# EAGLE design TOUv2 (EAGLE 6.4)
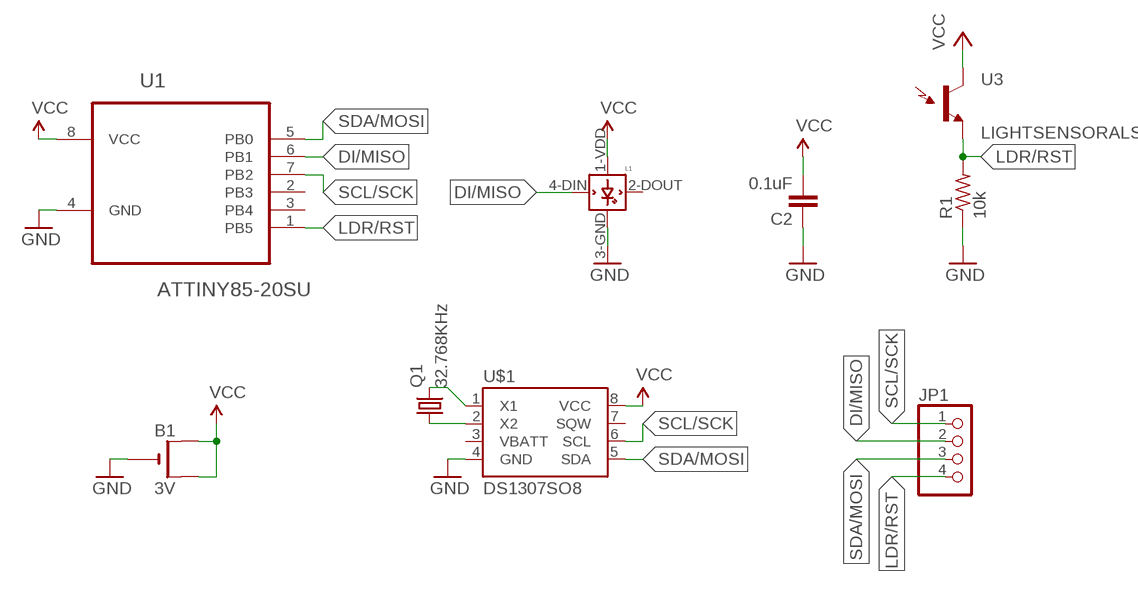
[diagram p0: schematic, sheet 1]

## Parts
B1  3V  CR2032THM  [CR2032-THRU]
C2  0.1uF  CAP0603-CAP  [0603-CAP]
JP1  PINHD-1X4  [1X04]
L1  WS2812B  [WS2812B]
Q1  32.768KHz  CRYSTALCTS406  [CTS406]
R1  10k  R-US_R0402  [R0402]
U1  ATTINY85-20SU  [SOIC127P798X216-8N]
U3  LIGHTSENSORALS  [ALS-PT19]
U$1  DS1307SO8  [SO08]

## Nets
DI/MISO: JP1.2 L1.4-DIN(DIN) U1.6(PB1)
GND: B1.- C2.1 L1.3-GND(GND) R1.1 U1.4(GND) U$1.4(GND)
LDR/RST: JP1.4 R1.2 U1.1(PB5) U3.E(E1)
N$1: Q1.1 U$1.2(X2)
N$2: Q1.3 U$1.1(X1)
SCL/SCK: JP1.1 U1.7(PB2) U$1.6(SCL)
SDA/MOSI: JP1.3 U1.5(PB0) U$1.5(SDA)
VCC: B1.+1(+) B1.+2(+1) C2.2 L1.1-VDD(VDD) U1.8(VCC) U3.C(C1) U$1.8(VCC)
Unconnected: L1.2-DOUT(DOUT) U1.2(PB3) U1.3(PB4) U$1.3(VBATT) U$1.7(SQW)

## Library data of the parts
B1 = adafruit:CR2032
C2 = SparkFun:CAP: Capacitor Standard 0603 ceramic capacitor, and 0.1" leaded capacitor.
JP1 = pinhead:PINHD-1X4: PIN HEADER
L1 = adafruit:WS2812B
Q1 = adafruit:CRYSTAL: CRYSTAL; OC_FARNELL: unknown; OC_NEWARK: unknown
R1 = adafruit:R-US_: RESISTOR, American symbol
U1 = Atmel_By_element14_Batch_1-00:ATTINY85-20SU: 8-bit Microcontroller with In-System Programmable Flash; MPN: ATTINY85-20SU; OC_FARNELL: 1455164; OC_NEWARK: 58M3797; PACKAGE: SOIC-8; SUPPLIER: Atmel
U3 = SparkFun-Sensors:LIGHTSENSOR: Ambient Light Sensor Simple light detection sensor. Output varies with light intensity input. Spark Fun Electronics SKU : COM-08348; PROD_ID: IC-11836
U$1 = SparkFun-FreqCtrl:DS1307: I2C real-time clock with battery backup.

## Board
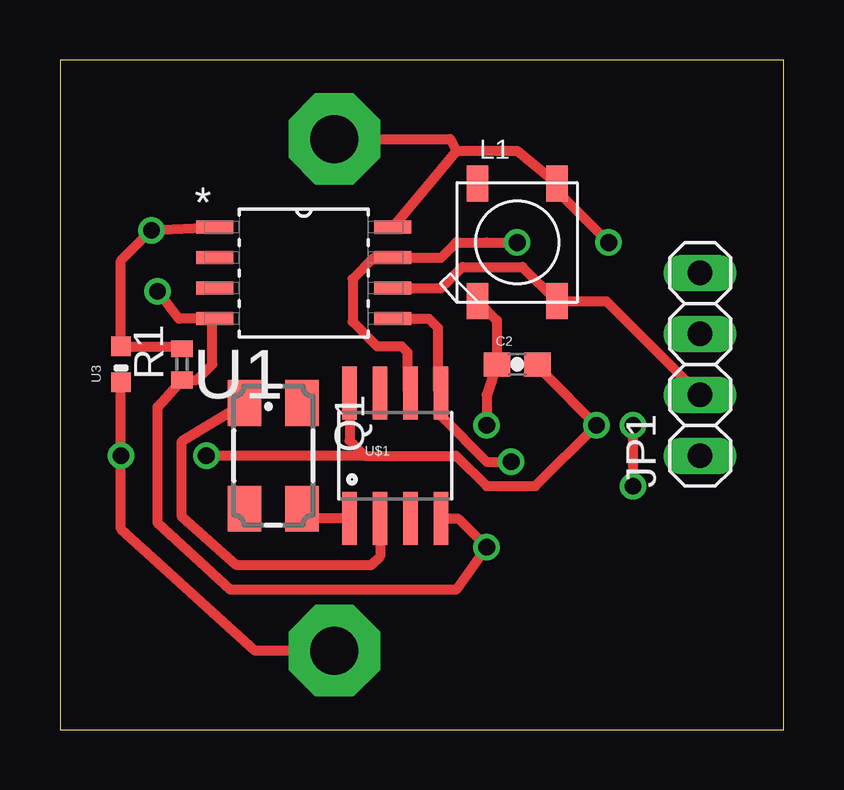
[diagram p1: board, top side]
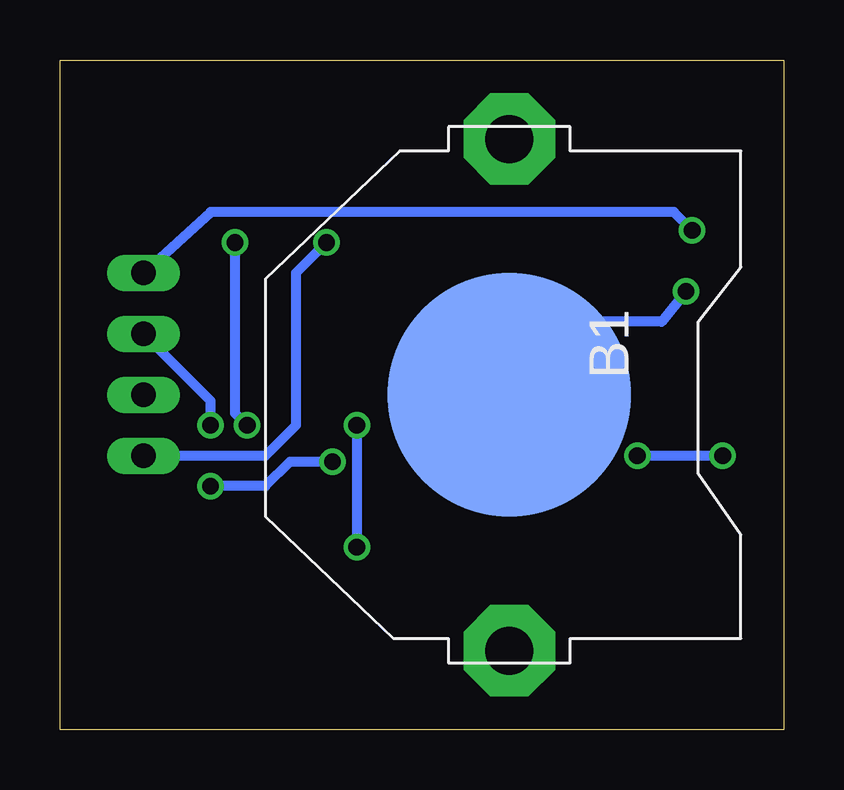
[diagram p2: board, bottom side, seen from below]

Size 30.15 x 27.93 mm. Coordinates in mm from the lower left corner, seen from the top.
Outline: 0,0 30.15,0 30.15,27.93 0,27.93 0,0
Copper layers (1*16): Top 0.035mm / dielectric 1.5mm / Bottom 0.035mm
Design rules "default": minimum track width 10mil, minimum drill 24mil, track to track 8mil, track to pad 8mil, pad to pad 8mil, via to via 8mil, smd to smd 8mil, copper to edge 40mil, drill to drill 8mil, minimum pad ring 10mil, minimum via ring 8mil, stop-mask expansion 4mil, vias tented up to drill 0mil, thermal gap 10mil

### Footprints (pad centres in the part's own frame; a part is rotated, then mirrored left to right if it is on the bottom)
CR2032-THRU = drill 2 pad 3.81 octagon: +1 -10.668,0; +2 10.668,0 | smd 10.16 x 10.16: - 0,0
0603-CAP = smd 1.1 x 1: 1 -0.85,0; 2 0.85,0
1X04 = drill 1.016 long: 1 -3.81,0; 2 -1.27,0; 3 1.27,0; 4 3.81,0
WS2812B = smd 1.5 x 0.9: 1-VDD 2.45,-1.65; 2-DOUT 2.45,1.65; 3-GND -2.45,1.65; 4-DIN -2.45,-1.65
CTS406 = smd 1.9 x 1.4: 1 -2.2,-1.2; 2 2.2,-1.2; 3 2.2,1.2; 4 -2.2,1.2
R0402 = smd 0.7 x 0.9: 1 -0.65,0; 2 0.65,0
SOIC127P798X216-8N = smd 1.549 x 0.533: 1 -3.708,1.905; 2 -3.708,0.635; 3 -3.708,-0.635; 4 -3.708,-1.905; 5 3.708,-1.905; 6 3.708,-0.635; 7 3.708,0.635; 8 3.708,1.905
ALS-PT19 = smd 0.8 x 0.8: C -0.75,0; E 0.75,0
SO08 = smd 0.61 x 2.21: 1 -1.905,-2.616; 2 -0.635,-2.616; 3 0.635,-2.616; 4 1.905,-2.616; 5 1.905,2.616; 6 0.635,2.616; 7 -0.635,2.616; 8 -1.905,2.616

### Placement (x,y rotation side)
B1  11.43,13.97 270 bottom
C2  19.05,15.24 0 top
JP1  26.67,15.24 90 top
L1  19.05,20.32 90 top
Q1  8.89,11.43 270 top
R1  5.08,15.24 90 top
U1  10.16,19.05 0 top
U3  2.54,15.24 90 top
U$1  13.97,11.43 0 top

### Tracks (layer width: path | path; a pad name or v marks a point on that pad's centre or on a via)
DI/MISO
  Top 0.406: U1.6 15.88,18.41 16.76,19.3 19.27,19.3 L1.4-DIN 22.77,17.87 JP1.2
GND  (via drill 0.7)
  Top 0.406: v17.78,12.7 17.78,13.97 C2.1 18.2,17.07 L1.3-GND | U$1.4 16.59,8.81 v17.78,7.62 16.51,5.84 7.11,5.84 4.06,8.64 4.06,13.46 R1.1 5.7,14.59 6.35,15.24 6.35,17.04 U1.4 4.95,17.15 v4.06,18.29
  Bottom 0.406: v17.78,12.7 v17.78,7.62 | v4.06,18.29 5.08,17.02 8.13,17.02 B1.-
LDR/RST  (via drill 0.7)
  Top 0.406: R1.2 4.98,15.99 U3.E 2.54,19.56 v3.81,20.83 U1.1
  Bottom 0.406: v3.81,20.83 4.57,21.59 23.88,21.59 JP1.4
N$1
  Top 0.406: U$1.2 13.34,7.24 12.95,6.86 7.37,6.86 5.08,8.89 5.08,12.04 Q1.1
N$2
  Top 0.406: U$1.1 10.09,8.81 Q1.3
SCL/SCK  (via drill 0.7)
  Top 0.406: 14.68,13.97 U$1.6 14.48,14.17 14.48,15.75 14.22,16 13.21,16 12.19,17.02 12.19,18.8 13.08,19.69 U1.7 15.88,19.69 16.51,20.32 17.78,20.32 v19.05,20.32
  Bottom 0.406: v19.05,20.32 20.32,19.05 20.32,12.7 21.59,11.43 JP1.1
SDA/MOSI  (via drill 0.7)
  Top 0.406: v18.8,11.18 17.78,11.18 15.88,13.08 U$1.5 15.75,14.17 15.75,16.76 15.37,17.15 U1.5 | v23.88,10.16 v23.88,12.7
  Bottom 0.406: v18.8,11.18 20.57,11.18 21.59,10.16 v23.88,10.16 | v23.88,12.7 23.88,13.72 JP1.3
VCC  (via drill 0.7)
  Top 0.406: U$1.8 12.06,12.06 12.7,11.43 | 12.7,11.43 v6.1,11.43 | 16.51,24.13 19.05,24.13 L1.1-VDD 20.7,22.48 v22.86,20.32 | 16.51,24.13 U1.8 | 12.7,11.43 16.51,11.43 17.78,10.16 19.81,10.16 v22.35,12.7 20.15,14.9 C2.2 | B1.+1 16.26,24.64 16.51,24.13 | B1.+2 8.13,3.3 2.54,8.38 v2.54,11.43 U3.C
  Bottom 0.406: v22.86,20.32 22.86,13.21 v22.35,12.7 | v2.54,11.43 v6.1,11.43